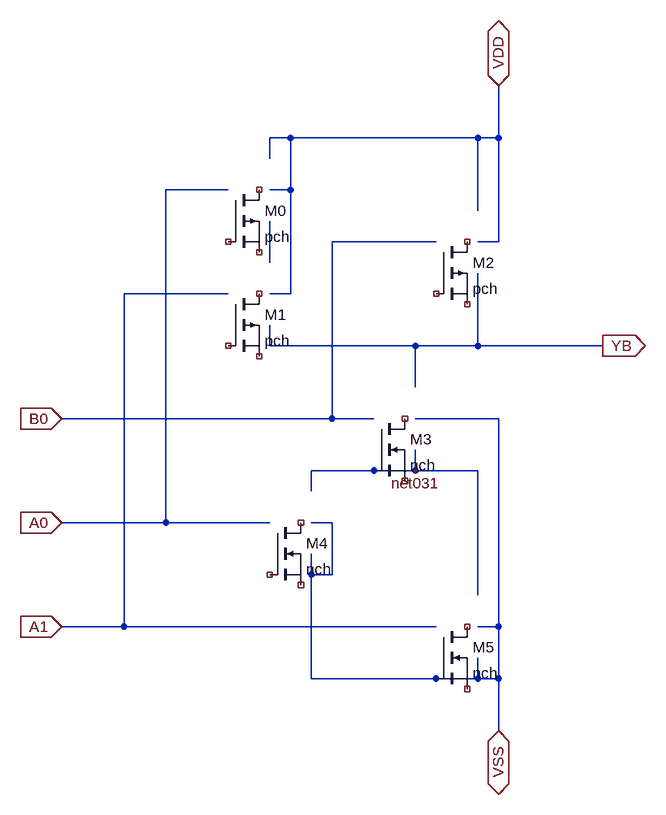
[diagram p0: schematic na212.asc]
na212.asc, the LTspice schematic file:
Version 4
SHEET 1 1008 1184
WIRE 416 256 448 256
WIRE 448 256 448 176
WIRE 448 416 448 256
WIRE 448 176 736 176
WIRE 416 416 448 416
WIRE 736 176 768 176
WIRE 768 336 768 176
WIRE 736 336 768 336
WIRE 768 96 768 176
WIRE 736 288 736 176
WIRE 416 176 448 176
WIRE 416 208 416 176
WIRE 416 368 416 304
WIRE 256 768 256 256
WIRE 256 256 352 256
WIRE 256 768 416 768
WIRE 96 768 256 768
WIRE 640 688 640 656
WIRE 640 688 736 688
WIRE 736 880 736 688
WIRE 480 688 640 688
WIRE 480 720 480 688
WIRE 96 608 512 608
WIRE 512 336 672 336
WIRE 512 608 512 336
WIRE 512 608 576 608
WIRE 768 928 768 608
WIRE 640 608 768 608
WIRE 480 848 512 848
WIRE 480 848 480 816
WIRE 480 768 512 768
WIRE 512 848 512 768
WIRE 768 1008 768 928
WIRE 736 928 768 928
WIRE 768 1088 768 1008
WIRE 736 1008 768 1008
WIRE 736 1008 736 976
WIRE 480 1008 736 1008
WIRE 480 1008 480 848
WIRE 736 496 928 496
WIRE 640 560 640 496
WIRE 640 496 736 496
WIRE 736 496 736 384
WIRE 416 496 640 496
WIRE 416 496 416 464
WIRE 192 416 352 416
WIRE 192 928 672 928
WIRE 192 928 192 416
WIRE 96 928 192 928
FLAG 640 688 net031
SYMBOL NMOS 672 928 R0
SYMATTR InstName M5
SYMATTR Value nch
SYMATTR Value2 w=2u l=1u
SYMBOL NMOS 416 768 R0
SYMATTR InstName M4
SYMATTR Value nch
SYMATTR Value2 w=2u l=1u
SYMBOL NMOS 576 608 R0
SYMATTR InstName M3
SYMATTR Value nch
SYMATTR Value2 w=2u l=1u
SYMBOL PMOS 672 336 R0
SYMATTR InstName M2
SYMATTR Value pch
SYMATTR Value2 w=6u l=1u
SYMBOL PMOS 352 416 R0
SYMATTR InstName M1
SYMATTR Value pch
SYMATTR Value2 w=6u l=1u
SYMBOL PMOS 352 256 R0
SYMATTR InstName M0
SYMATTR Value pch
SYMATTR Value2 w=6u l=1u
FLAG 928 496 YB
IOPIN 928 496 Out
FLAG 768 1088 VSS
IOPIN 768 1088 BiDir
FLAG 768 96 VDD
IOPIN 768 96 BiDir
FLAG 96 608 B0
IOPIN 96 608 In
FLAG 96 928 A1
IOPIN 96 928 In
FLAG 96 768 A0
IOPIN 96 768 In

The netlist it stands for:
* na212.asc
* M5: nch w=2u l=1u (symbol NMOS not certain, pin order unknown); nets seen at it: VSS
* M4: nch w=2u l=1u (symbol NMOS not certain, pin order unknown); nets seen at it: 
* M3: nch w=2u l=1u (symbol NMOS not certain, pin order unknown); nets seen at it: net031
* M2: pch w=6u l=1u (symbol PMOS not certain, pin order unknown); nets seen at it: 
* M1: pch w=6u l=1u (symbol PMOS not certain, pin order unknown); nets seen at it: 
* M0: pch w=6u l=1u (symbol PMOS not certain, pin order unknown); nets seen at it: 
.backanno
.end